# Altium schematic sheet GL3227_Core.SchDoc
size A4; SheetNumber: 1; SheetTotal: 2
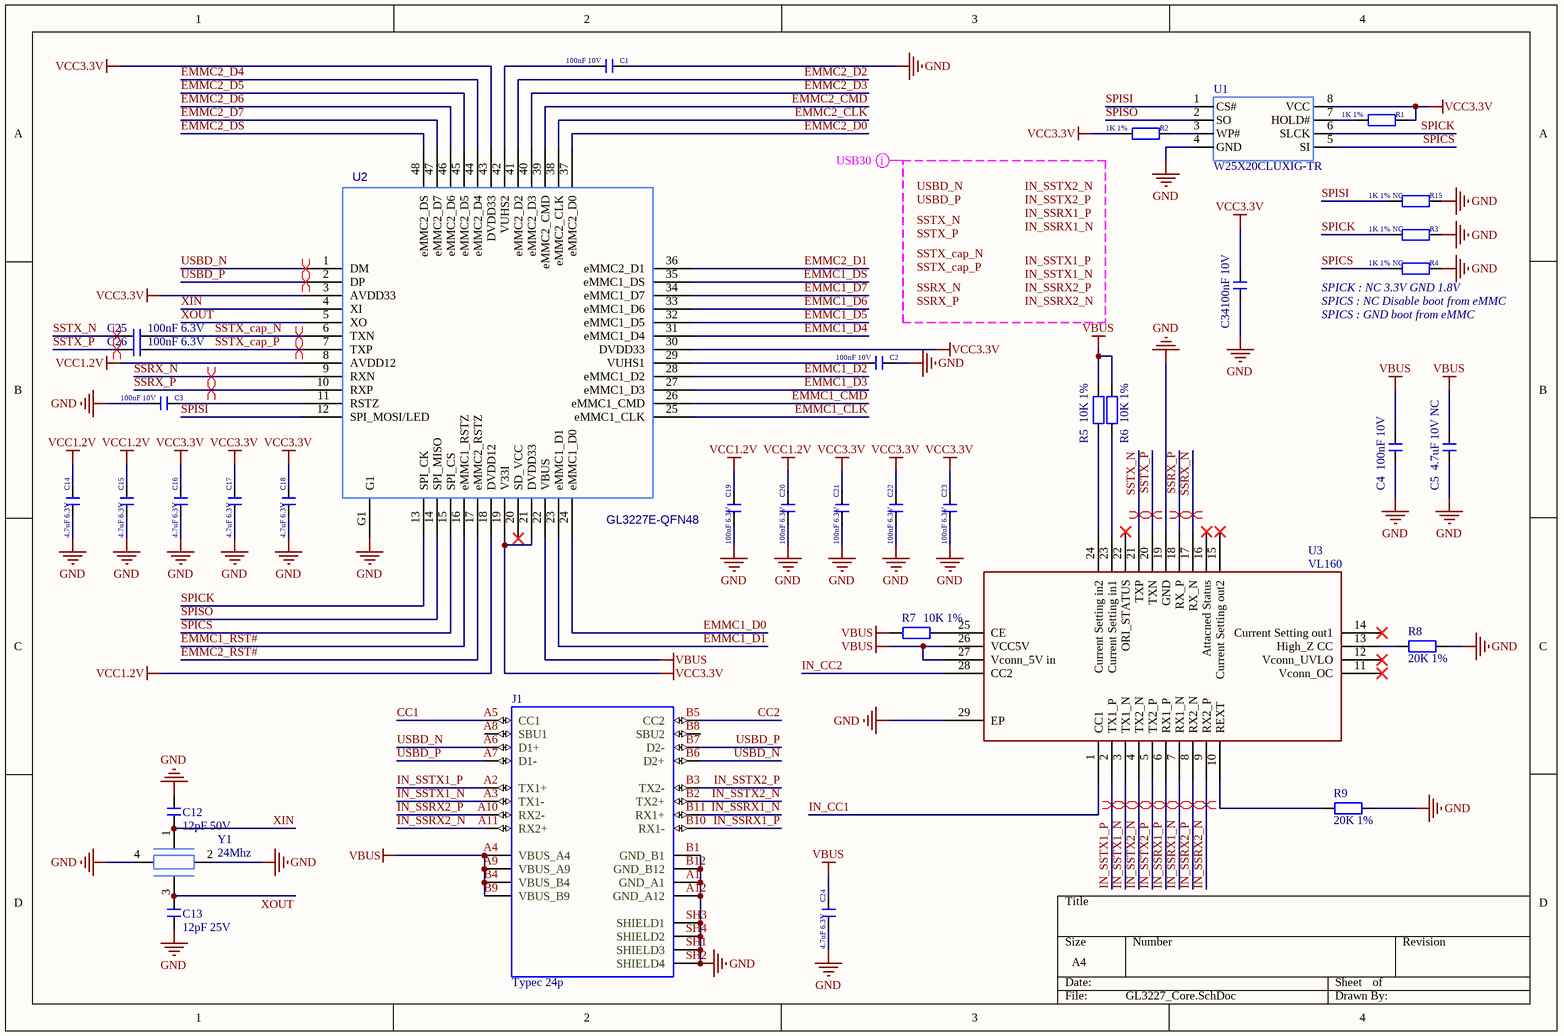
[diagram p0: GL3227_Core.SchDoc]

## Parts
C1  100nF 10V  [C0402_NS]
C2  100nF 10V  [C0402_NS]
C3  100nF 10V  [C0402_NS]
C4  100nF 10V  [C0402_NS]
C5  4.7uF 10V NC  [C0402_NS]
C12  12pF 50V  [C0402_NS]
C13  12pF 25V  [C0402_NS]
C14  4.7uF 6.3V  [C0402_NS]
C15  4.7uF 6.3V  [C0402_NS]
C16  4.7uF 6.3V  [C0402_NS]
C17  4.7uF 6.3V  [C0402_NS]
C18  4.7uF 6.3V  [C0402_NS]
C19  100nF 6.3V  [C0402_NS]
C20  100nF 6.3V  [C0402_NS]
C21  100nF 6.3V  [C0402_NS]
C22  100nF 6.3V  [C0402_NS]
C23  100nF 6.3V  [C0402_NS]
C24  4.7uF 6.3V  [C0402_NS]
C25  100nF 6.3V  [C0402_NS]
C26  100nF 6.3V  [C0402_NS]
C34  100nF 10V  [C0402_NS]
J1  Typec 24p  [USB-C-SMD_TYPEC-1103-BRP24]
R1  1K 1%  [R0402_NS]
R2  1K 1%  [R0402_NS]
R3  1K 1% NC  [R0402_NS]
R4  1K 1% NC  [R0402_NS]
R5  10K 1%  [R0402_NS]
R6  10K 1%  [R0402_NS]
R7  10K 1%  [R0402_NS]
R8  20K 1%  [R0402_NS]
R9  20K 1%  [R0402_NS]
R15  1K 1% NC  [R0402_NS]
U1  W25X20CLUXIG-TR  [USON-8_L1.5-W1.5-P0.40-BL-EP]
U2  value GL3227E-QFN48  [QFN48 7X7_M]  (hidden comment: GL3227E-QFN48-ON2)
U3  VL160  [MQFN-28_L4.5-W3.5-P0.40-BL-EP]
Y1  24Mhz  [OSC-1612-4P]

## Nets
GND: C1.1 C2.1 C3.2 C4.1 C5.1 C12.1 C13.1 C14.2 C15.2 C16.2 C17.2 C18.2 C19.2 C20.2 C21.2 C22.2 C23.2 C24.2 C34.1 J1.A1(GND_A1) J1.A12(GND_A12) J1.B1(GND_B1) J1.B12(GND_B12) J1.SH1(SHIELD3) J1.SH2(SHIELD4) J1.SH3(SHIELD1) J1.SH4(SHIELD2) R3.1 R4.1 R8.1 R9.1 R15.1 U1.4(GND) U2.G1 U3.19(GND) U3.29(EP) Y1.2(GND) Y1.4(GND)
VBUS: C4.2 C5.2 C24.1 J1.A4(VBUS_A4) J1.A9(VBUS_A9) J1.B4(VBUS_B4) J1.B9(VBUS_B9) R5.1 R6.1 R7.2 U2.22(VBUS) U3.26(VCC5V) U3.27(Vconn_5V_in)
VCC1.2V: C14.1 C15.1 C19.1 C20.1 U2.8(AVDD12) U2.18(DVDD12)
VCC3.3V: C16.1 C17.1 C18.1 C21.1 C22.1 C23.1 C34.2 R1.1 R2.2 U1.8(VCC) U2.3(AVDD33) U2.19(V33I) U2.21(DVDD33) U2.30(DVDD33) U2.43(DVDD33)
CC1: J1.A5(CC1)
CC2: J1.B5(CC2)
EMMC1_CLK: U2.25(eMMC1_CLK)
EMMC1_CMD: U2.26(eMMC1_CMD)
EMMC1_D0: U2.24(eMMC1_D0)
EMMC1_D1: U2.23(eMMC1_D1)
EMMC1_D2: U2.28(eMMC1_D2)
EMMC1_D3: U2.27(eMMC1_D3)
EMMC1_D4: U2.31(eMMC1_D4)
EMMC1_D5: U2.32(eMMC1_D5)
EMMC1_D6: U2.33(eMMC1_D6)
EMMC1_D7: U2.34(eMMC1_D7)
EMMC1_DS: U2.35(eMMC1_DS)
EMMC1_RST#: U2.16(eMMC1_RSTZ)
EMMC2_CLK: U2.38(eMMC2_CLK)
EMMC2_CMD: U2.39(eMMC2_CMD)
EMMC2_D0: U2.37(eMMC2_D0)
EMMC2_D1: U2.36(eMMC2_D1)
EMMC2_D2: U2.41(eMMC2_D2)
EMMC2_D3: U2.40(eMMC2_D3)
EMMC2_D4: U2.44(eMMC2_D4)
EMMC2_D5: U2.45(eMMC2_D5)
EMMC2_D6: U2.46(eMMC2_D6)
EMMC2_D7: U2.47(eMMC2_D7)
EMMC2_DS: U2.48(eMMC2_DS)
EMMC2_RST#: U2.17(eMMC2_RSTZ)
IN_CC1: U3.1(CC1)
IN_CC2: U3.28(CC2)
IN_SSRX1_N: J1.B11(RX1+) U3.7(RX1_N)
IN_SSRX1_P: J1.B10(RX1-) U3.6(RX1_P)
IN_SSRX2_N: J1.A11(RX2+) U3.9(RX2_P)
IN_SSRX2_P: J1.A10(RX2-) U3.8(RX2_N)
IN_SSTX1_N: J1.A3(TX1-) U3.3(TX1_N)
IN_SSTX1_P: J1.A2(TX1+) U3.2(TX1_P)
IN_SSTX2_N: J1.B2(TX2+) U3.4(TX2_N)
IN_SSTX2_P: J1.B3(TX2-) U3.5(TX2_P)
SPICK: R3.2 U1.6(SLCK) U2.13(SPI_CK)
SPICS: R4.2 U1.5(SI) U2.15(SPI_CS)
SPISI: R15.2 U1.1(CS#) U2.12(SPI_MOSI/LED)
SPISO: U1.2(SO) U2.14(SPI_MISO)
SSRX_N: U2.9(RXN) U3.17(RX_N)
SSRX_P: U2.10(RXP) U3.18(RX_P)
SSTX_cap_N: C25.1 U2.6(TXN)
SSTX_cap_P: C26.1 U2.7(TXP)
SSTX_N: C25.2 U3.21(TXP)
SSTX_P: C26.2 U3.20(TXN)
USBD_N: J1.A6(D1+) J1.B6(D2+) U2.1(DM)
USBD_P: J1.A7(D1-) J1.B7(D2-) U2.2(DP)
XIN: C12.2 U2.4(XI) Y1.1(XTAL_N)
XOUT: C13.2 U2.5(XO) Y1.3(XTAL_P)
NetC1_2: C1.2 U2.42(VUHS2)
NetC2_2: C2.2 U2.29(VUHS1)
NetC3_1: C3.1 U2.11(RSTZ)
NetR1_2: R1.2 U1.7(HOLD#)
NetR2_1: R2.1 U1.3(WP#)
NetR5_2: R5.2 U3.24(Current_Setting_in2)
NetR6_2: R6.2 U3.23(Current_Setting_in1)
NetR7_1: R7.1 U3.25(CE)
NetR8_2: R8.2 U3.13(High_Z_CC)
NetR9_2: R9.2 U3.10(REXT)

Not connected (* = marked no-connect by the designer): J1 A8(SBU1) B8(SBU2); U2 20(SD_VCC)*; U3 11(Vconn_OC)* 12(Vconn_UVLO)* 14(Current_Setting_out1)* 15(Current_Setting_out2)* 16(Attacned_Status)* 22(ORI_STATUS)*

## Layout directives
differential pair: IN_SSRX1_N, IN_SSRX1_P, IN_SSRX2_N, IN_SSRX2_P, IN_SSTX1_N, IN_SSTX1_P, IN_SSTX2_N, IN_SSTX2_P, SSRX_N, SSRX_P, SSTX_cap_N, SSTX_cap_P, SSTX_N, SSTX_P, USBD_N, USBD_P
net class USB30; rule Differential Pairs Routing [Pref Gap = 6mil    Min Gap  = 6mil    Max Gap  = 6milPref Width = 5.59mil    Min Width  = 5.59mil    Max Width  = 5.59mil]: IN_SSRX1_N, IN_SSRX1_P, IN_SSRX2_N, IN_SSRX2_P, IN_SSTX1_N, IN_SSTX1_P, IN_SSTX2_N, IN_SSTX2_P, SSRX_N, SSRX_P, SSTX_cap_N, SSTX_cap_P, SSTX_N, SSTX_P, USBD_N, USBD_P

## Notes on the sheet
- (near R4) SPICK : NC 3.3V GND 1.8V
- (near R4) SPICS : NC Disable boot from eMMC
- (near R4) SPICS : GND boot from eMMC
- Labels drawn without touching a wire or pin: IN_SSRX1_N, IN_SSRX1_P, IN_SSRX2_N, IN_SSRX2_P, IN_SSTX1_N, IN_SSTX1_P, IN_SSTX2_N, IN_SSTX2_P, SSRX_N, SSRX_P, SSTX_cap_N, SSTX_cap_P, SSTX_N, SSTX_P, USBD_N, USBD_P

## Library data of the parts
C1-C5 C12-C26 C34 = C: 无极性贴片电容; 版权归属: 源创客; 材质: X7R; BOM名称: 无极性贴片电容; 学习资源: www.ooocke.com
J1 = Typec 24p: USB-C (USB TYPE-C) USB 3.2 Gen 2 (USB 3.1 Gen 2, Superspeed + (USB 3.1)) Receptacle Connector 24 Position Surface Mount, Right Angle; Through Hole; MF: Molex; MP: 1054500101; SnapEDA_Link: https://www.snapeda.com/parts/1054500101/Molex/view-part/?ref=snap; Package: None; Value: *; Check_prices: https://www.snapeda.com/parts/1054500101/Molex/view-part/?ref=eda
R1-R9 R15 = R: 贴片电阻; 版权归属: 源创客; BOM名称: 贴片电阻; 学习资源: www.ooocke.com
U1 = P25D40H
U2 = GL3227E-QFN48-ON2: pin to pad: G1>49; Part Reference: U1; PCB Footprint: sks-qfn48-6x6x0_4a
Y1 = Crystal